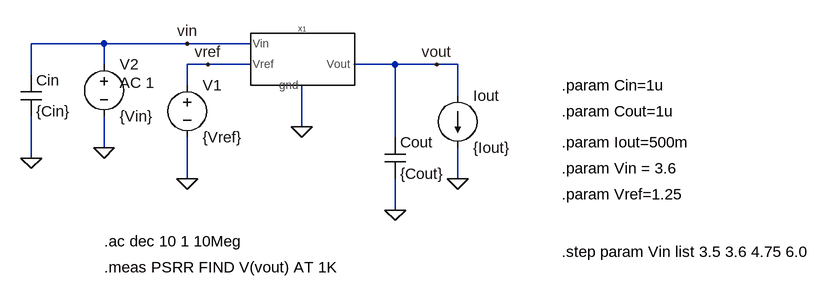
[diagram p0: schematic PSRR_6p35.asc]
PSRR_6p35.asc, the LTspice schematic file:
Version 4
SHEET 1 1068 680
WIRE -160 48 -272 48
WIRE -32 48 -160 48
WIRE 64 48 -32 48
WIRE -160 80 -160 48
WIRE 0 80 -32 80
WIRE 64 80 0 80
WIRE 288 80 224 80
WIRE 352 80 288 80
WIRE 384 80 352 80
WIRE -272 96 -272 48
WIRE -32 112 -32 80
WIRE 384 128 384 80
WIRE 144 176 144 112
WIRE 288 192 288 80
WIRE -160 208 -160 160
WIRE -272 224 -272 160
WIRE -32 256 -32 192
WIRE 384 256 384 208
WIRE 288 304 288 256
FLAG 0 80 vref
FLAG -160 208 0
FLAG -32 48 vin
FLAG 288 304 0
FLAG 384 256 0
FLAG 352 80 vout
FLAG 144 176 0
FLAG -272 224 0
FLAG -32 256 0
SYMBOL LDO_basic 144 64 R0
SYMATTR InstName X1
SYMBOL voltage -32 96 R0
WINDOW 123 0 0 Left 0
WINDOW 39 0 0 Left 0
SYMATTR InstName V1
SYMATTR Value {Vref}
SYMBOL voltage -160 64 R0
WINDOW 123 24 44 Left 2
WINDOW 39 0 0 Left 0
SYMATTR Value2 AC 1
SYMATTR InstName V2
SYMATTR Value {Vin}
SYMBOL cap 272 192 R0
SYMATTR InstName Cout
SYMATTR Value {Cout}
SYMBOL current 384 128 R0
WINDOW 123 0 0 Left 0
WINDOW 39 0 0 Left 0
SYMATTR InstName Iout
SYMATTR Value {Iout}
SYMBOL cap -288 96 R0
SYMATTR InstName Cin
SYMATTR Value {Cin}
TEXT -160 352 Left 2 !.ac dec 10 1 10Meg
TEXT 544 200 Left 2 !.param Iout=500m
TEXT 544 152 Left 2 !.param Cout=1u
TEXT 544 112 Left 2 !.param Cin=1u
TEXT 544 240 Left 2 !.param Vin = 3.6
TEXT 544 280 Left 2 !.param Vref=1.25
TEXT 544 368 Left 2 !.step param Vin list 3.5 3.6 4.75 6.0
TEXT -160 392 Left 2 !.meas PSRR FIND V(vout) AT 1K

The netlist it stands for:
* PSRR_6p35.asc
XX1 vin vref 0 vout LDO_basic  ; pins Vin Vref gnd Vout
V1 vref 0 {Vref}
V2 vin 0 {Vin} AC 1
Cout vout 0 {Cout}
Iout vout 0 {Iout}
Cin vin 0 {Cin}
.ac dec 10 1 10Meg
.param Iout=500m
.param Cout=1u
.param Cin=1u
.param Vin = 3.6
.param Vref=1.25
.step param Vin list 3.5 3.6 4.75 6.0
.meas PSRR FIND V(vout) AT 1K
.backanno
.end